# EAGLE design tick-shield-mk-2.0 (EAGLE 6.5.0)
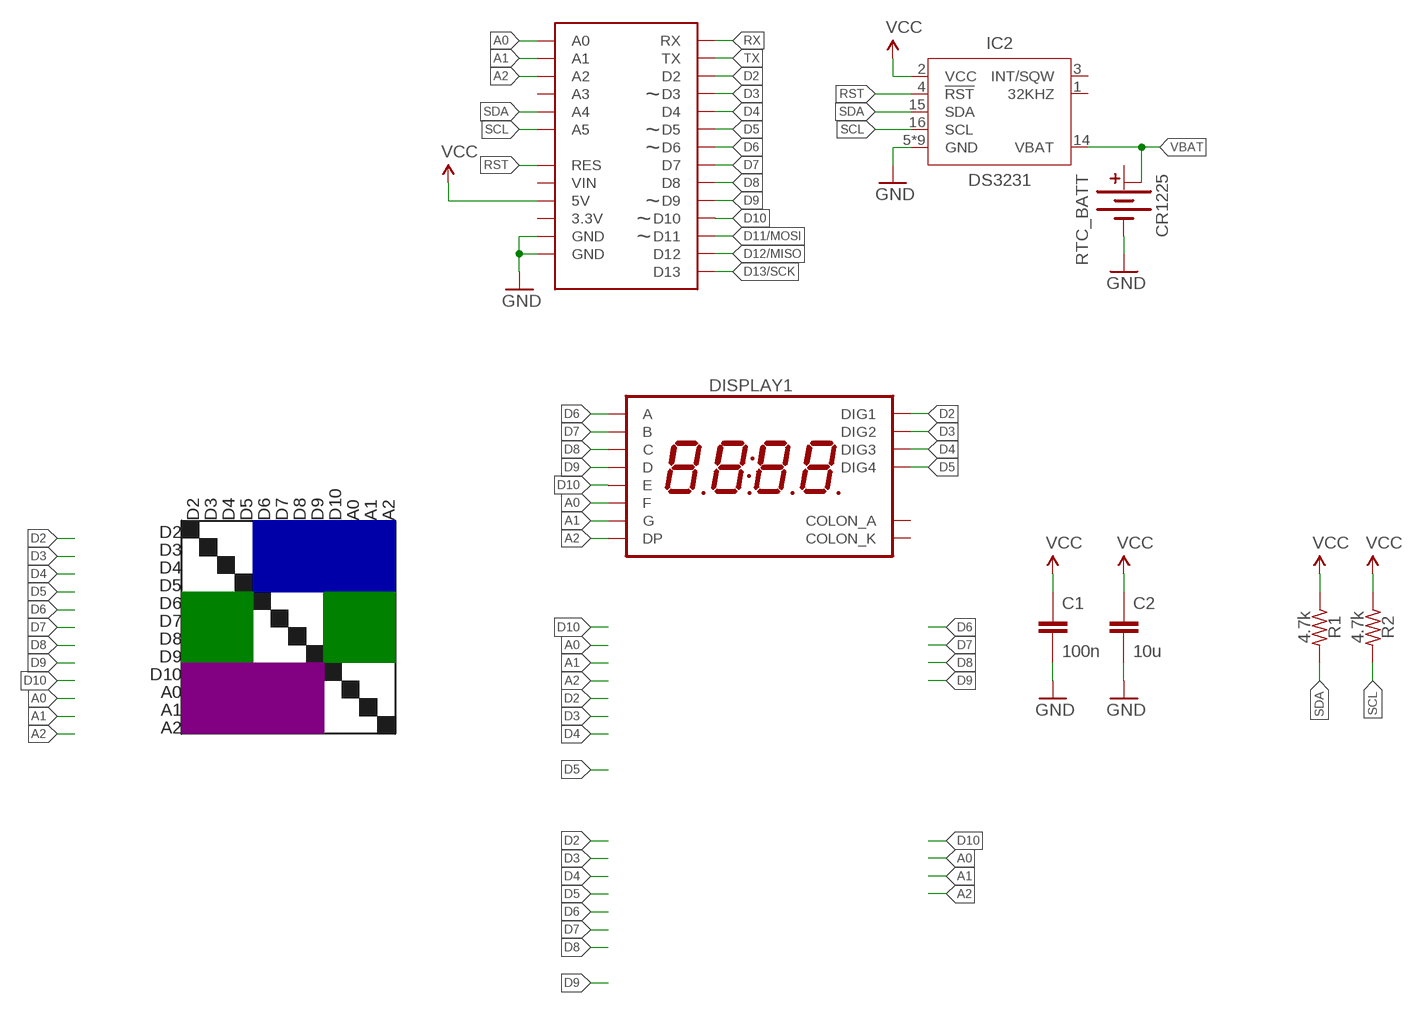
[diagram p0: schematic, sheet 1]

## Parts
C1  100n  CAPACITOR-CERAMIC025-024X044  [C025-024X044]
C2  10u  CAPACITOR-CERAMIC050-025X075  [C050-025X075]
DISPLAY1  7SEG_4DIGIT_COLONTICK  [7SEG_4DIG_TICK]
IC2  DS3231  [SO16W]
R1  4.7k  RESISTORPTH-AXIAL-7.62MM  [RESISTOR-AXIAL-PTH-7.62MM]
R2  4.7k  RESISTORPTH-AXIAL-7.62MM  [RESISTOR-AXIAL-PTH-7.62MM]
RTC_BATT  CR1225  BATTERY-COINCR1225_PTH3  [BATTCON_12MM_PTH3]
U$1  ARDUINO_SHIELD_SMALLER  [ARDUINO_SHIELD_NOOUTLINE_INSIDE_SMALLER]

## Nets
A0: DISPLAY1.P$12(F) U$1.A0
A1: DISPLAY1.P$5(G) U$1.A1
A2: DISPLAY1.P$3(DP) U$1.A2
D2: DISPLAY1.P$14(DIG1) U$1.D2
D3: DISPLAY1.P$11(DIG2) U$1.D3
D4: DISPLAY1.P$10(DIG3) U$1.D4
D5: DISPLAY1.P$6(DIG4) U$1.D5
D6: DISPLAY1.P$13(A) U$1.D6
D7: DISPLAY1.P$9(B) U$1.D7
D8: DISPLAY1.P$4(C) U$1.D8
D9: DISPLAY1.P$2(D) U$1.D9
D10: DISPLAY1.P$1(E) U$1.D10
D11/MOSI: U$1.D11
D12/MISO: U$1.D12
D13/SCK: U$1.D13
GND: C1.2 C2.2 IC2.5(GND) IC2.6(GND) IC2.7(GND) IC2.8(GND) IC2.9(GND) IC2.10(GND) IC2.11(GND) IC2.12(GND) IC2.13(GND) RTC_BATT.- U$1.GND@0(GND) U$1.GND@1(GND)
RST: IC2.4(!RST) U$1.RES
RX: U$1.RX
SCL: IC2.16(SCL) R2.P$2 U$1.A5
SDA: IC2.15(SDA) R1.P$2 U$1.A4
TX: U$1.TX
VBAT: IC2.14(VBAT) RTC_BATT.+@3(+1) RTC_BATT.+@4(+1)
VCC: C1.1 C2.1 IC2.2(VCC) R1.P$1 R2.P$1 U$1.5V
Unconnected: DISPLAY1.P$7(COLON_K) DISPLAY1.P$8(COLON_A) IC2.1(32KHZ) IC2.3(INT/SQW) RTC_BATT.+@1(+) RTC_BATT.+@2(+) U$1.3.3V U$1.A3 U$1.VIN

## Notes on the sheet
- D2 | D3 | D4 | D5 | D6 | D7 | D8 | D9 | D10 | A0 | A1 | A2
- D2
- D3
- D4
- D5
- D6
- D7
- D8
- D9
- D10
- A0
- A1
- A2

## Library data of the parts
C1 C2 = A_butts:CAPACITOR-CERAMIC: CAPACITOR, European symbol
DISPLAY1 = A_butts:7SEG_4DIGIT_COLON
IC2 = A_butts:DS3231
R1 R2 = A_butts:RESISTOR: RESISTOR, American symbol
RTC_BATT = A_butts:BATTERY-COIN
U$1 = A_butts:ARDUINO_SHIELD_SMALLER

## Board
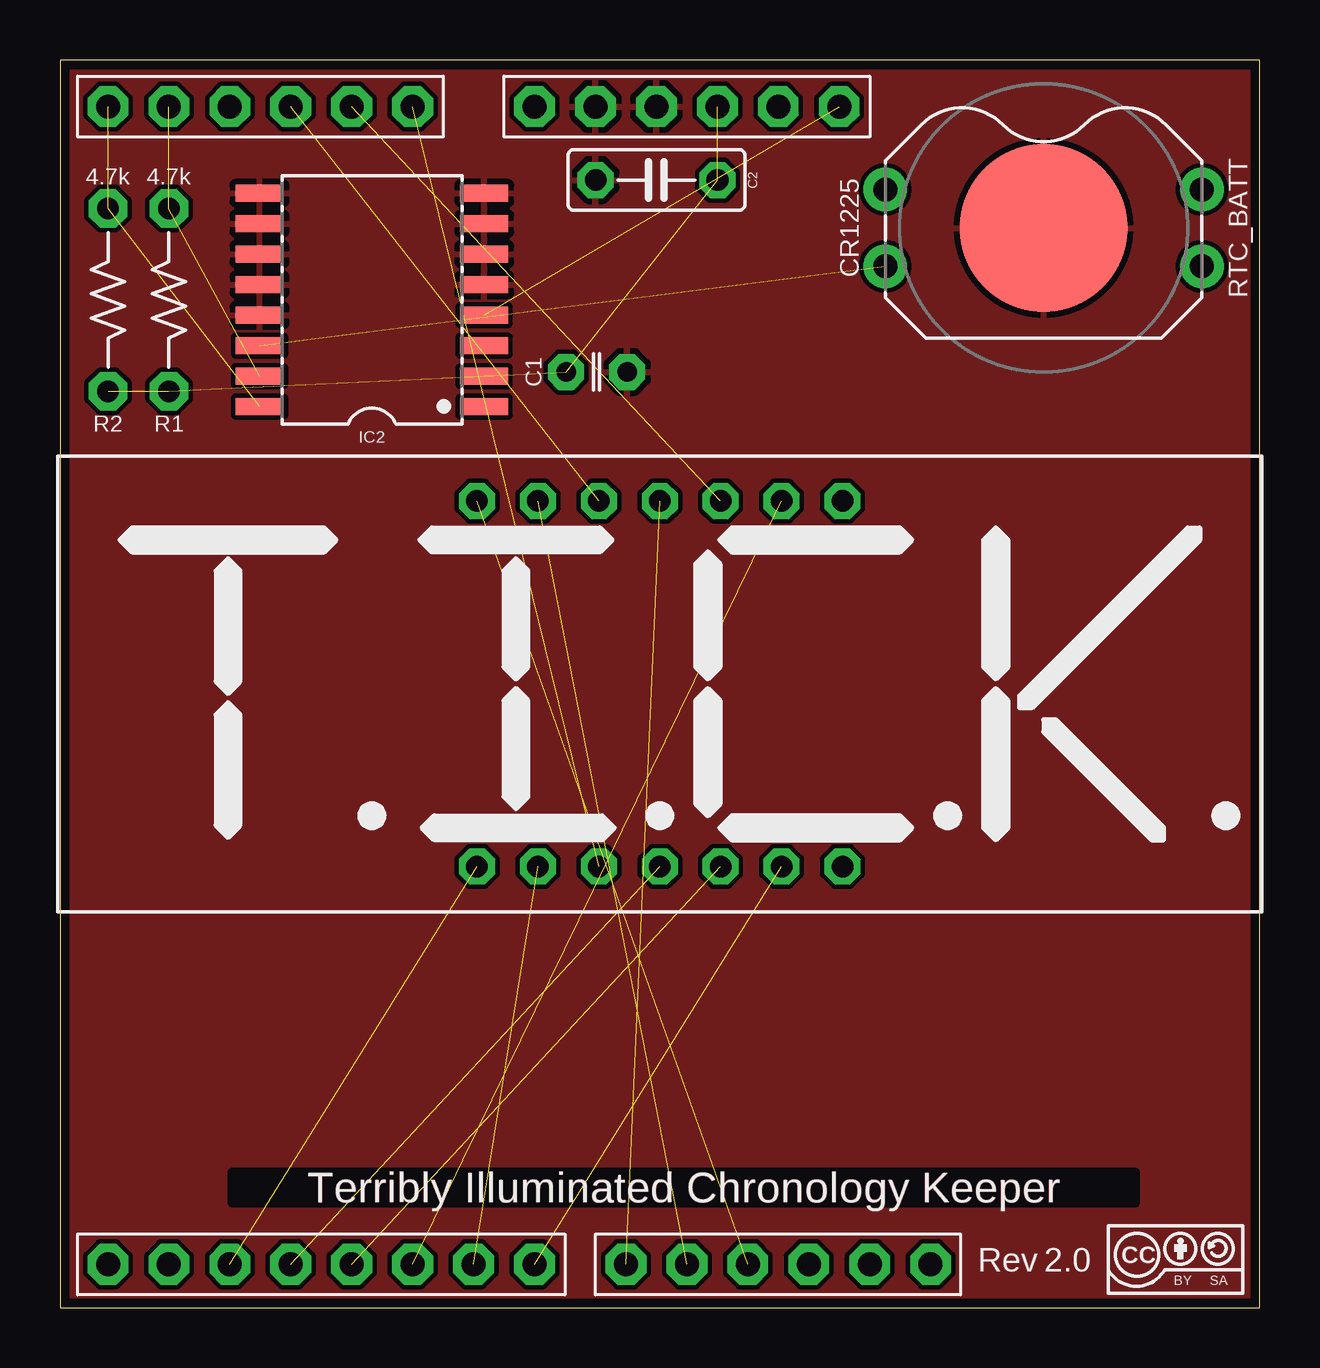
[diagram p1: board, top side]
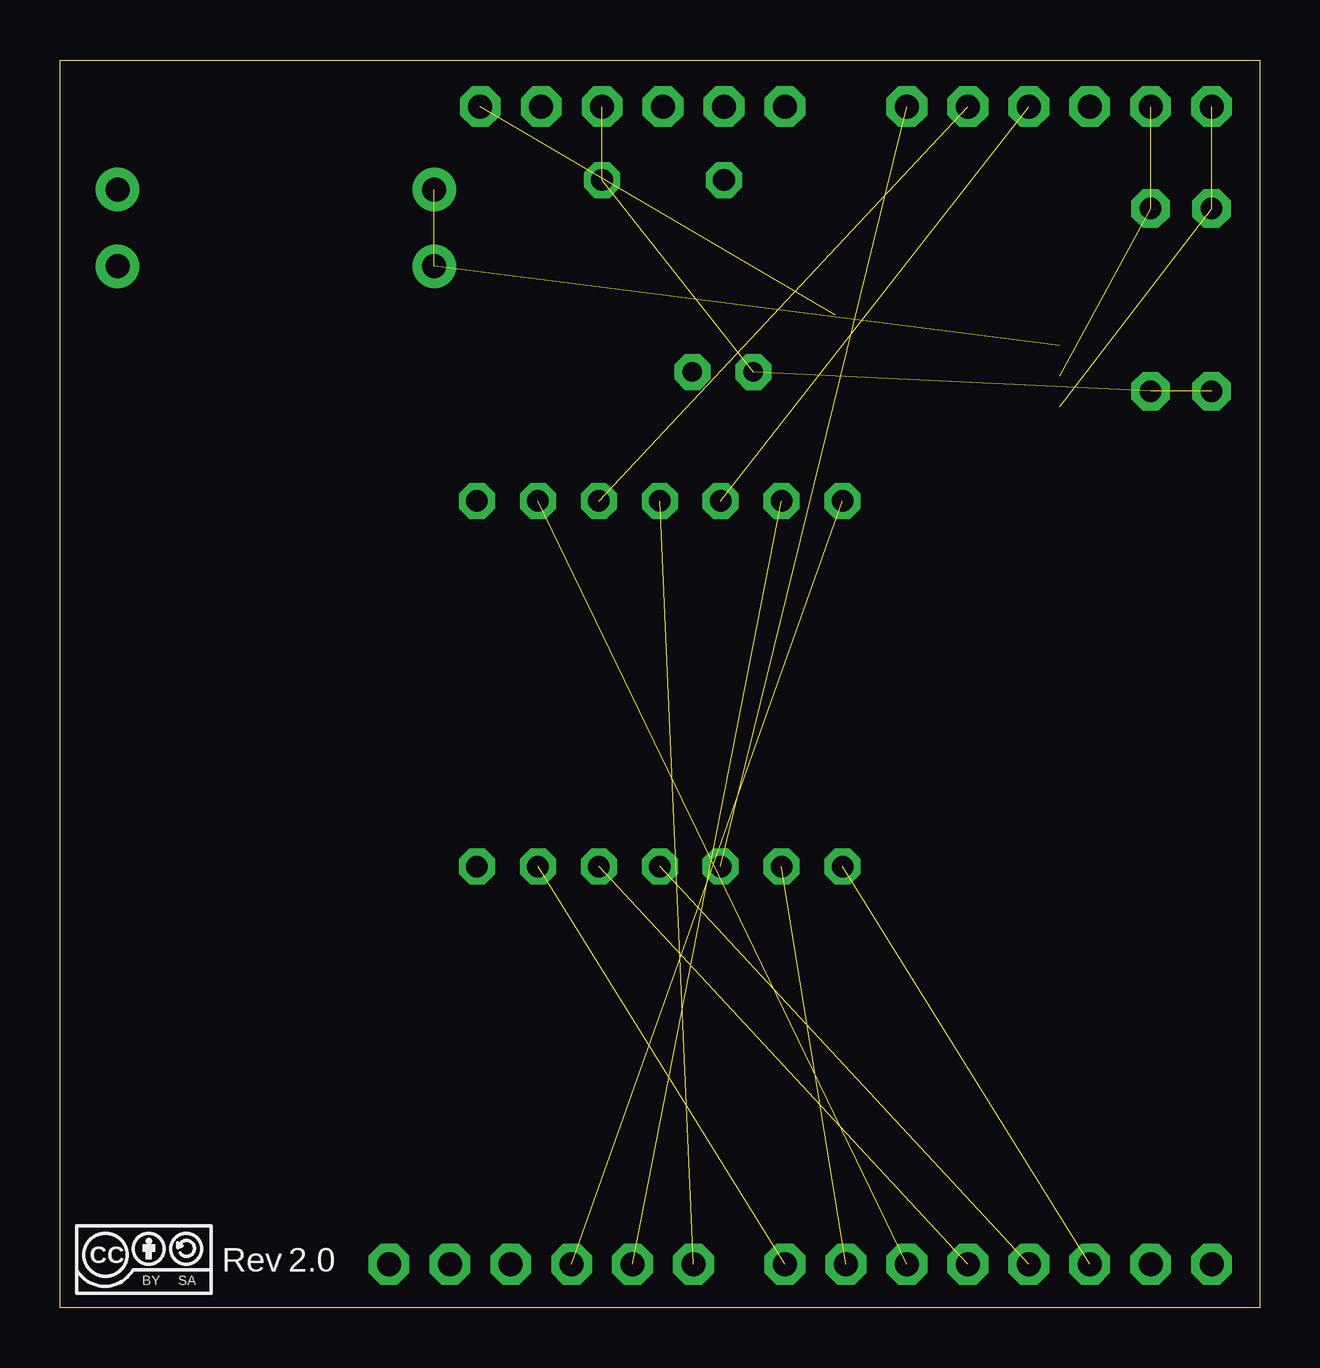
[diagram p2: board, bottom side, seen from below]

Size 50 x 52 mm. Coordinates in mm from the lower left corner, seen from the top.
Outline: 50,52 0,52 0,0 50,0 50,52
Copper layers (1*16): Top 0.0356mm / dielectric 1.5011mm / Bottom 0.0356mm
Design rules "LaenPCBOrder_2": minimum track width 6mil, minimum drill 13mil, track to track 6mil, track to pad 6mil, pad to pad 6mil, via to via 6mil, smd to smd 6mil, copper to edge 15mil, drill to drill 6mil, minimum pad ring 7mil, minimum via ring 7mil, stop-mask expansion 3mil, vias tented up to drill 20mil, thermal gap 10mil

### Footprints (pad centres in the part's own frame; a part is rotated, then mirrored left to right if it is on the bottom)
C025-024X044 = drill 0.813 pad 1.5 octagon: 1 -1.27,0; 2 1.27,0
C050-025X075 = drill 0.9 pad 1.5 octagon: 1 -2.54,0; 2 2.54,0
7SEG_4DIG_TICK = drill 0.9 pad 1.5 octagon: P$1 -7.62,7.62; P$2 -5.08,7.62; P$3 -2.54,7.62; P$4 0,7.62; P$5 2.54,7.62; P$6 5.08,7.62; P$7 7.62,7.62; P$8 7.62,-7.62; P$9 5.08,-7.62; P$10 2.54,-7.62; P$11 0,-7.62; P$12 -2.54,-7.62; P$13 -5.08,-7.62; P$14 -7.62,-7.62
SO16W = smd 0.7 x 2: 1 -4.445,-4.685; 2 -3.175,-4.685; 3 -1.905,-4.685; 4 -0.635,-4.685; 5 0.635,-4.685; 6 1.905,-4.685; 7 3.175,-4.685; 8 4.445,-4.685; 9 4.445,4.685; 10 3.175,4.685; 11 1.905,4.685; 12 0.635,4.685; 13 -0.635,4.685; 14 -1.905,4.685; 15 -3.175,4.685; 16 -4.445,4.685
RESISTOR-AXIAL-PTH-7.62MM = drill 0.9 pad 1.6 octagon: P$1 -3.81,0; P$2 3.81,0
BATTCON_12MM_PTH3 = drill 1 pad 1.8: +@1 -6.6,1.6; +@2 -6.6,-1.6; +@3 6.6,-1.6; +@4 6.6,1.6 | smd 7 x 7: - 0,0
ARDUINO_SHIELD_NOOUTLINE_INSIDE_SMALLER = drill 1 pad 1.7 octagon: 3.3V 48.26,-27.94; 5V 48.26,-25.4; A0 48.26,-12.7; A1 48.26,-10.16; A2 48.26,-7.62; A3 48.26,-5.08; A4 48.26,-2.54; A5 48.26,0; D2 0,-5.08; D3 0,-7.62; D4 0,-10.16; D5 0,-12.7; D6 0,-15.24; D7 0,-17.78; D8 0,-21.59; D9 0,-24.13; D10 0,-26.67; D11 0,-29.21; D12 0,-31.75; D13 0,-34.29; GND@0 48.26,-22.86; GND@1 48.26,-20.32; RES 48.26,-30.48; RX 0,0; TX 0,-2.54; VIN 48.26,-17.78

### Placement (x,y rotation side)
C1  22.37,39 0 top
C2  24.86,47 180 top
DISPLAY1  25,26 0 top
IC2  13,42 90 top
R1  4.54,42 90 top
R2  2,42 90 top
RTC_BATT  41,45 180 top
U$1  2,1.8 90 top
U$3  [CC-BY-SA-4.0-NO-URL]  46.5,2 0 top
U$4  [CC-BY-SA-4.0-NO-URL]  46.5,2 0 bottom
U$7  [OSHWLOGO_TOP_0.2_A]  57.5,42.5 0 top  (outside the outline)
U$8  [OSHWLOGO_TOP_0.2_A]  57.5,42.5 0 bottom  (outside the outline)

### Tracks (layer width: path | path; a pad name or v marks a point on that pad's centre or on a via)
A0  (1 unrouted)
A1  (1 unrouted)
A2  (1 unrouted)
D2  (1 unrouted)
D3  (1 unrouted)
D4  (1 unrouted)
D5  (1 unrouted)
D6  (1 unrouted)
D7  (1 unrouted)
D8  (1 unrouted)
D9  (1 unrouted)
D10  (1 unrouted)
GND
  pour Top (isolate 0.2): 50,52 50,0 0,0 0,52
RST  (1 unrouted)
SCL  (2 unrouted)
SDA  (2 unrouted)
VBAT  (2 unrouted)
VCC  (5 unrouted)

### Text on the board
Top: Terribly Illuminated Chronology Keeper
tPlace: Terribly Illuminated Chronology Keeper | Rev
bPlace: Rev